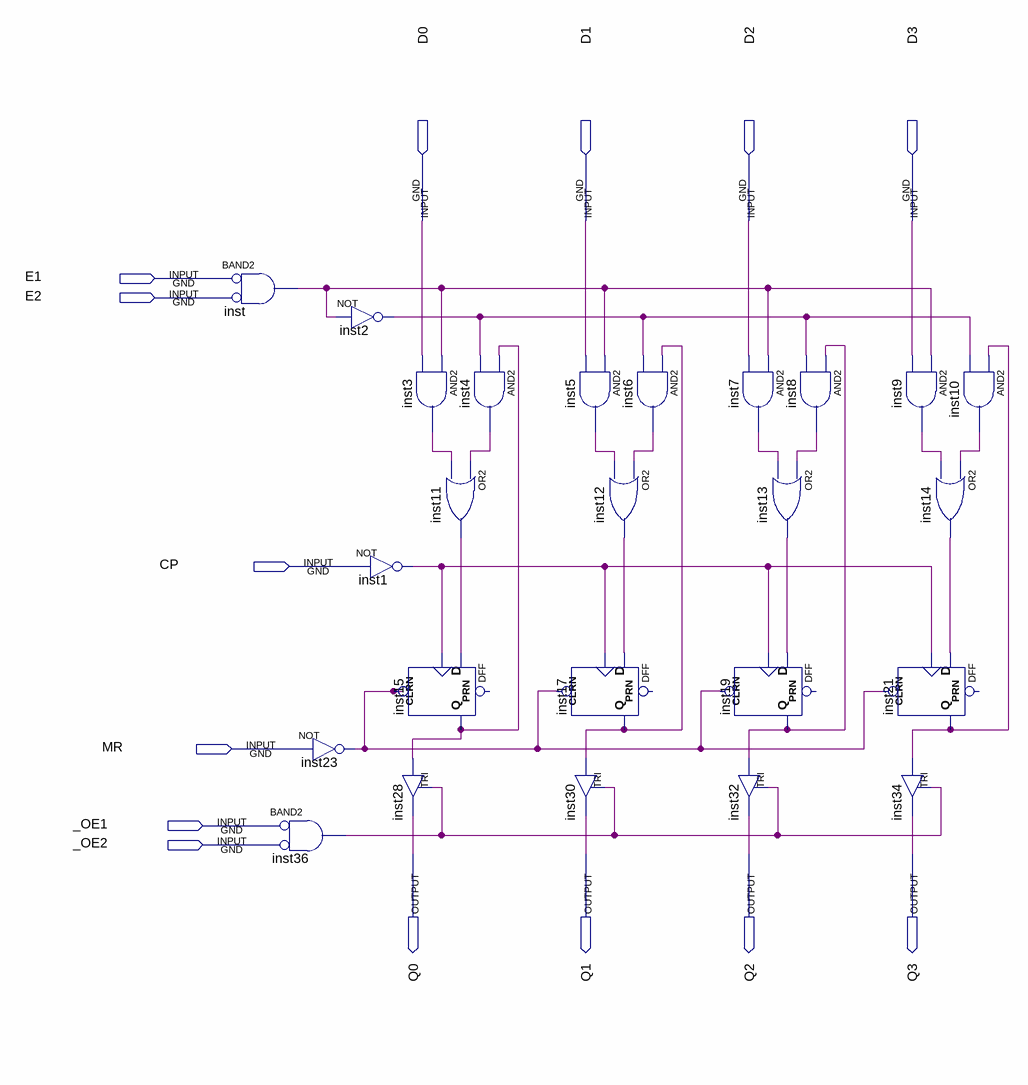
[diagram p0: schematic sheet]
// Quartus schematic 74LS173.bdf as structural Verilog: 25 symbols, 14 pins
module \74LS173  (
  input  D0,
  input  D1,
  input  D2,
  input  D3,
  input  E1,
  input  E2,
  input  CP,
  input  MR,
  input  _OE1,
  input  _OE2,
  output Q0,
  output Q1,
  output Q2,
  output Q3
);

  wire inst1_out, inst2_out, inst3_out, inst4_out, inst5_out, inst6_out, inst7_out, inst8_out, inst9_out,
       inst10_out, inst11_out, inst12_out, inst13_out, inst14_out, inst15_q, inst17_q, inst19_q, inst21_q,
       inst23_out, inst36_out, inst_out;

  and inst (inst_out, ~E1, ~E2);  // BAND2
  not inst23 (inst23_out, MR);
  and inst36 (inst36_out, ~_OE1, ~_OE2);  // BAND2
  not inst2 (inst2_out, inst_out);
  not inst1 (inst1_out, CP);
  and inst3 (inst3_out, inst_out, D0);
  or inst11 (inst11_out, inst4_out, inst3_out);
  DFF inst15 (.CLRN(inst23_out), .CLK(inst1_out), .D(inst11_out), .Q(inst15_q));  // open: PRN
  TRI inst28 (.IN(inst15_q), .OE(inst36_out), .OUT(Q0));
  and inst4 (inst4_out, inst15_q, inst2_out);
  and inst5 (inst5_out, inst_out, D1);
  or inst12 (inst12_out, inst6_out, inst5_out);
  DFF inst17 (.CLRN(inst23_out), .CLK(inst1_out), .D(inst12_out), .Q(inst17_q));  // open: PRN
  TRI inst30 (.IN(inst17_q), .OE(inst36_out), .OUT(Q1));
  and inst6 (inst6_out, inst17_q, inst2_out);
  and inst7 (inst7_out, inst_out, D2);
  or inst13 (inst13_out, inst8_out, inst7_out);
  DFF inst19 (.CLRN(inst23_out), .CLK(inst1_out), .D(inst13_out), .Q(inst19_q));  // open: PRN
  TRI inst32 (.IN(inst19_q), .OE(inst36_out), .OUT(Q2));
  and inst8 (inst8_out, inst19_q, inst2_out);
  and inst9 (inst9_out, inst_out, D3);
  DFF inst21 (.CLRN(inst23_out), .CLK(inst1_out), .D(inst14_out), .Q(inst21_q));  // open: PRN
  TRI inst34 (.IN(inst21_q), .OE(inst36_out), .OUT(Q3));
  and inst10 (inst10_out, inst21_q, inst2_out);
  or inst14 (inst14_out, inst10_out, inst9_out);
endmodule
